# Altium schematic sheet CPU_DDR.SchDoc
size A3; SheetNumber: 6; SheetTotal: 21
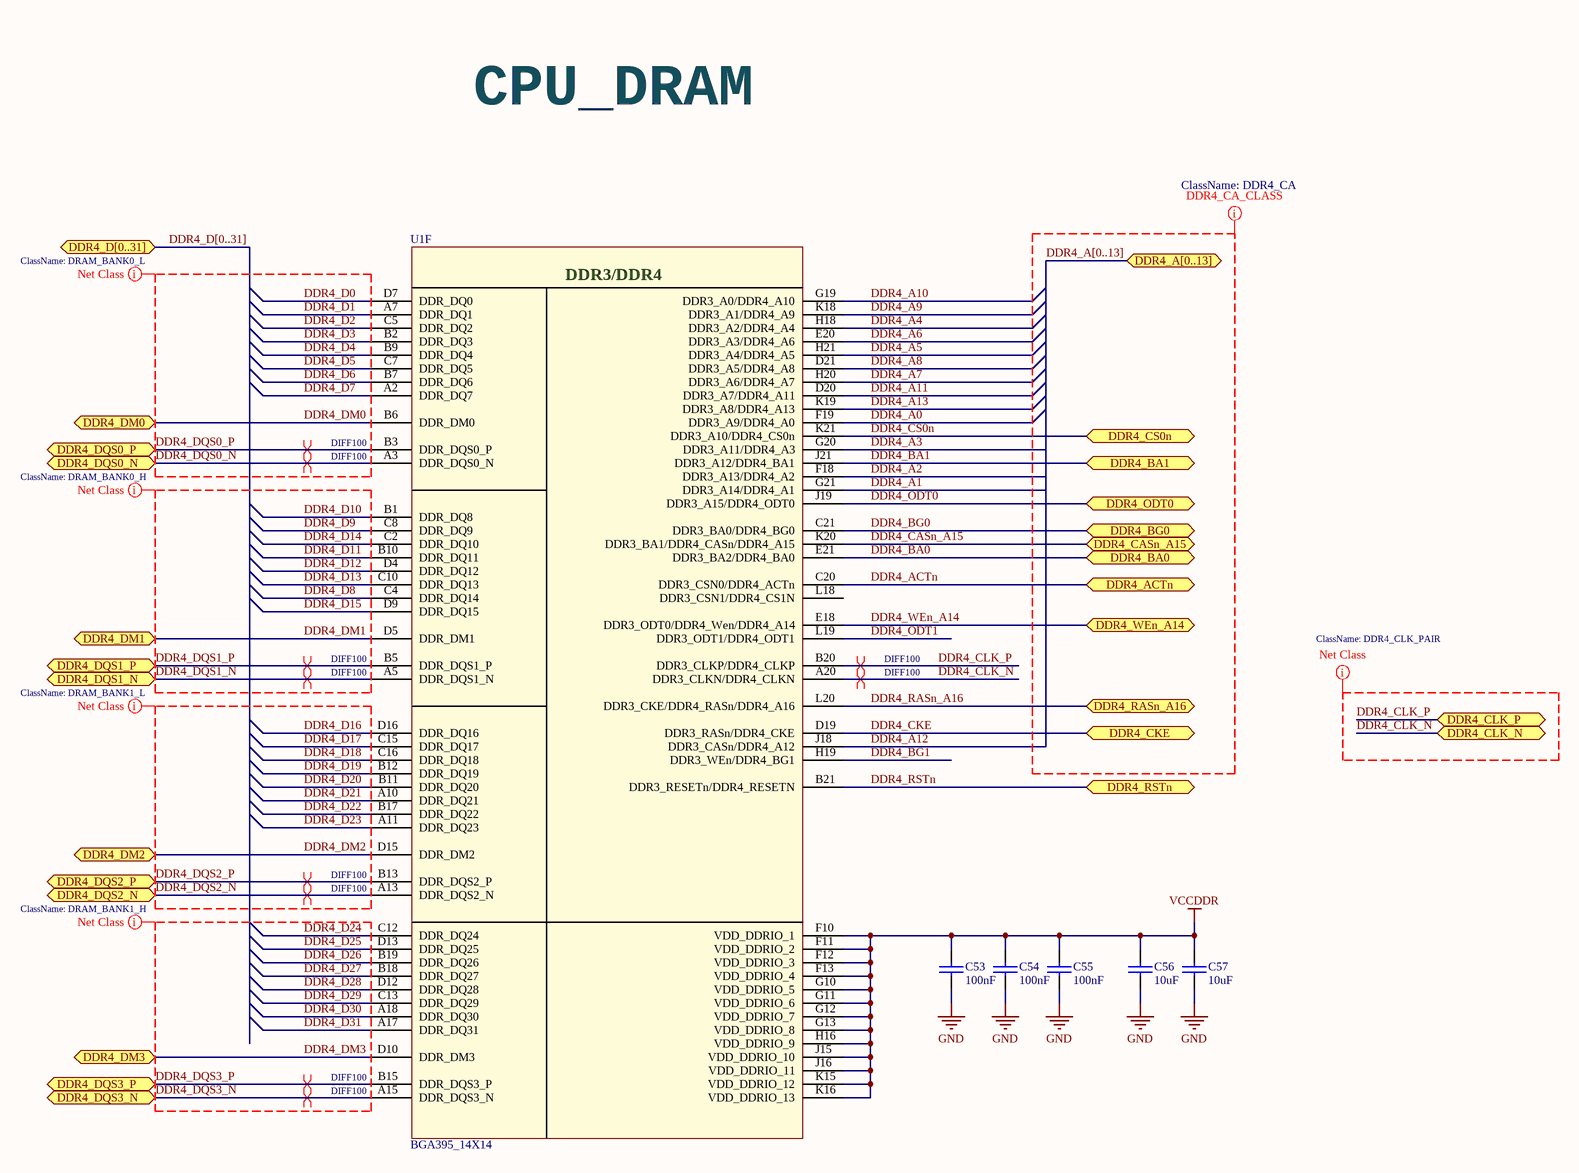
[diagram p0: CPU_DDR.SchDoc]

## Parts
C53  100nF  [0402_CC - C]
C54  100nF  [0402_CC - C]
C55  100nF  [0402_CC - C]
C56  10uF  [0603_CC]
C57  10uF  [0603_CC]
U1  BGA395_14X14  [BGA395C65P21X21_1750X1750X117]  (part F of 17)

## Ports
DDR4_A[0..13] (bidir), DDR4_ACTn (bidir), DDR4_BA0 (bidir), DDR4_BA1 (bidir), DDR4_BG0 (bidir), DDR4_CASn_A15 (bidir), DDR4_CKE (bidir), DDR4_CLK_N (bidir), DDR4_CLK_P (bidir), DDR4_CS0n (bidir), DDR4_D[0..31] (bidir), DDR4_DM0 (bidir), DDR4_DM1 (bidir), DDR4_DM2 (bidir), DDR4_DM3 (bidir), DDR4_DQS0_N (bidir), DDR4_DQS0_P (bidir), DDR4_DQS1_N (bidir), DDR4_DQS1_P (bidir), DDR4_DQS2_N (bidir), DDR4_DQS2_P (bidir), DDR4_DQS3_N (bidir), DDR4_DQS3_P (bidir), DDR4_ODT0 (bidir), DDR4_RASn_A16 (bidir), DDR4_RSTn (bidir), DDR4_WEn_A14 (bidir)

## Nets
GND: C53.2 C54.2 C55.2 C56.2 C57.2
VCCDDR: C53.1 C54.1 C55.1 C56.1 C57.1 U1.F10(VDD_DDRIO_1) U1.F11(VDD_DDRIO_2) U1.F12(VDD_DDRIO_3) U1.F13(VDD_DDRIO_4) U1.G10(VDD_DDRIO_5) U1.G11(VDD_DDRIO_6) U1.G12(VDD_DDRIO_7) U1.G13(VDD_DDRIO_8) U1.H16(VDD_DDRIO_9) U1.J15(VDD_DDRIO_10) U1.J16(VDD_DDRIO_11) U1.K15(VDD_DDRIO_12) U1.K16(VDD_DDRIO_13)
DDR4_A0: U1.F19(DDR3_A9/DDR4_A0)
DDR4_A1: U1.G21(DDR3_A14/DDR4_A1)
DDR4_A2: U1.F18(DDR3_A13/DDR4_A2)
DDR4_A3: U1.G20(DDR3_A11/DDR4_A3)
DDR4_A4: U1.H18(DDR3_A2/DDR4_A4)
DDR4_A5: U1.H21(DDR3_A4/DDR4_A5)
DDR4_A6: U1.E20(DDR3_A3/DDR4_A6)
DDR4_A7: U1.H20(DDR3_A6/DDR4_A7)
DDR4_A8: U1.D21(DDR3_A5/DDR4_A8)
DDR4_A9: U1.K18(DDR3_A1/DDR4_A9)
DDR4_A10: U1.G19(DDR3_A0/DDR4_A10)
DDR4_A11: U1.D20(DDR3_A7/DDR4_A11)
DDR4_A12: U1.J18(DDR3_CASn/DDR4_A12)
DDR4_A13: U1.K19(DDR3_A8/DDR4_A13)
DDR4_ACTn: U1.C20(DDR3_CSN0/DDR4_ACTn) ; port DDR4_ACTn
DDR4_BA0: U1.E21(DDR3_BA2/DDR4_BA0) ; port DDR4_BA0
DDR4_BA1: U1.J21(DDR3_A12/DDR4_BA1) ; port DDR4_BA1
DDR4_BG0: U1.C21(DDR3_BA0/DDR4_BG0) ; port DDR4_BG0
DDR4_BG1: U1.H19(DDR3_WEn/DDR4_BG1)
DDR4_CASn_A15: U1.K20(DDR3_BA1/DDR4_CASn/DDR4_A15) ; port DDR4_CASn_A15
DDR4_CKE: U1.D19(DDR3_RASn/DDR4_CKE) ; port DDR4_CKE
DDR4_CLK_N: U1.A20(DDR3_CLKN/DDR4_CLKN) ; port DDR4_CLK_N
DDR4_CLK_P: U1.B20(DDR3_CLKP/DDR4_CLKP) ; port DDR4_CLK_P
DDR4_CS0n: U1.K21(DDR3_A10/DDR4_CS0n) ; port DDR4_CS0n
DDR4_D0: U1.D7(DDR_DQ0)
DDR4_D1: U1.A7(DDR_DQ1)
DDR4_D2: U1.C5(DDR_DQ2)
DDR4_D3: U1.B2(DDR_DQ3)
DDR4_D4: U1.B9(DDR_DQ4)
DDR4_D5: U1.C7(DDR_DQ5)
DDR4_D6: U1.B7(DDR_DQ6)
DDR4_D7: U1.A2(DDR_DQ7)
DDR4_D8: U1.C4(DDR_DQ14)
DDR4_D9: U1.C8(DDR_DQ9)
DDR4_D10: U1.B1(DDR_DQ8)
DDR4_D11: U1.B10(DDR_DQ11)
DDR4_D12: U1.D4(DDR_DQ12)
DDR4_D13: U1.C10(DDR_DQ13)
DDR4_D14: U1.C2(DDR_DQ10)
DDR4_D15: U1.D9(DDR_DQ15)
DDR4_D16: U1.D16(DDR_DQ16)
DDR4_D17: U1.C15(DDR_DQ17)
DDR4_D18: U1.C16(DDR_DQ18)
DDR4_D19: U1.B12(DDR_DQ19)
DDR4_D20: U1.B11(DDR_DQ20)
DDR4_D21: U1.A10(DDR_DQ21)
DDR4_D22: U1.B17(DDR_DQ22)
DDR4_D23: U1.A11(DDR_DQ23)
DDR4_D24: U1.C12(DDR_DQ24)
DDR4_D25: U1.D13(DDR_DQ25)
DDR4_D26: U1.B19(DDR_DQ26)
DDR4_D27: U1.B18(DDR_DQ27)
DDR4_D28: U1.D12(DDR_DQ28)
DDR4_D29: U1.C13(DDR_DQ29)
DDR4_D30: U1.A18(DDR_DQ30)
DDR4_D31: U1.A17(DDR_DQ31)
DDR4_DM0: U1.B6(DDR_DM0) ; port DDR4_DM0
DDR4_DM1: U1.D5(DDR_DM1) ; port DDR4_DM1
DDR4_DM2: U1.D15(DDR_DM2) ; port DDR4_DM2
DDR4_DM3: U1.D10(DDR_DM3) ; port DDR4_DM3
DDR4_DQS0_N: U1.A3(DDR_DQS0_N) ; port DDR4_DQS0_N
DDR4_DQS0_P: U1.B3(DDR_DQS0_P) ; port DDR4_DQS0_P
DDR4_DQS1_N: U1.A5(DDR_DQS1_N) ; port DDR4_DQS1_N
DDR4_DQS1_P: U1.B5(DDR_DQS1_P) ; port DDR4_DQS1_P
DDR4_DQS2_N: U1.A13(DDR_DQS2_N) ; port DDR4_DQS2_N
DDR4_DQS2_P: U1.B13(DDR_DQS2_P) ; port DDR4_DQS2_P
DDR4_DQS3_N: U1.A15(DDR_DQS3_N) ; port DDR4_DQS3_N
DDR4_DQS3_P: U1.B15(DDR_DQS3_P) ; port DDR4_DQS3_P
DDR4_ODT0: U1.J19(DDR3_A15/DDR4_ODT0) ; port DDR4_ODT0
DDR4_ODT1: U1.L19(DDR3_ODT1/DDR4_ODT1)
DDR4_RASn_A16: U1.L20(DDR3_CKE/DDR4_RASn/DDR4_A16) ; port DDR4_RASn_A16
DDR4_RSTn: U1.B21(DDR3_RESETn/DDR4_RESETN) ; port DDR4_RSTn
DDR4_WEn_A14: U1.E18(DDR3_ODT0/DDR4_Wen/DDR4_A14) ; port DDR4_WEn_A14

Not connected (* = marked no-connect by the designer): U1 L18(DDR3_CSN1/DDR4_CS1N)

## Buses and harness runs
bus DDR4_A[0..13] = port DDR4_A[0..13]
bus DDR4_D[0..31] = port DDR4_D[0..31]

## Layout directives
net class DDR4_CA: DDR4_A[0..13]
net class DRAM_BANK0_L: DDR4_D0, DDR4_D1, DDR4_D2, DDR4_D3, DDR4_D4, DDR4_D5, DDR4_D6, DDR4_D7, DDR4_DM0, DDR4_DQS0_N, DDR4_DQS0_P
net class DRAM_BANK0_H: DDR4_D8, DDR4_D9, DDR4_D10, DDR4_D11, DDR4_D12, DDR4_D13, DDR4_D14, DDR4_D15, DDR4_DM1, DDR4_DQS1_N, DDR4_DQS1_P
net class DRAM_BANK1_L: DDR4_D16, DDR4_D17, DDR4_D18, DDR4_D19, DDR4_D20, DDR4_D21, DDR4_D22, DDR4_D23, DDR4_DM2, DDR4_DQS2_N, DDR4_DQS2_P
net class DRAM_BANK1_H: DDR4_D24, DDR4_D25, DDR4_D26, DDR4_D27, DDR4_D28, DDR4_D29, DDR4_D30, DDR4_D31, DDR4_DM3, DDR4_DQS3_N, DDR4_DQS3_P
differential pair; net class DIFF100: DDR4_CLK_N, DDR4_CLK_P, DDR4_DQS0_N, DDR4_DQS0_P, DDR4_DQS1_N, DDR4_DQS1_P, DDR4_DQS2_N, DDR4_DQS2_P, DDR4_DQS3_N, DDR4_DQS3_P
net class DDR4_CLK_PAIR: DDR4_CLK_N, DDR4_CLK_P

## Notes on the sheet
- CPU_DRAM
- (in symbol RK3328, part F) DDR3/DDR4

## Library data of the parts
C53-C57 = CAP_NP: CLASS: DISCRETE
U1 = RK3328: By AAR